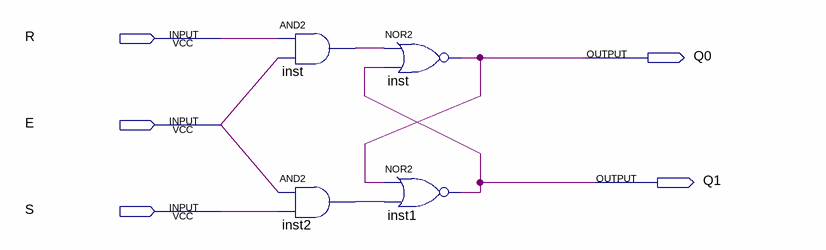
[diagram p0: schematic sheet]
// Quartus schematic register_sr.bdf as structural Verilog: 4 symbols, 5 pins
module register_sr (
  input  R,
  input  E,
  input  S,
  output Q0,
  output Q1
);

  wire inst2_out, inst_out;

  and inst (inst_out, R, E);
  and inst2 (inst2_out, E, S);
  nor inst_dup2 (Q0, inst_out, Q1);
  nor inst1 (Q1, Q0, inst2_out);
endmodule
